# Altium schematic sheet Thermokoppel.SchDoc: Soldeerstation
size A4; Author: Alexander Petry; CompanyName: PXL; SheetNumber: 1; SheetTotal: 5
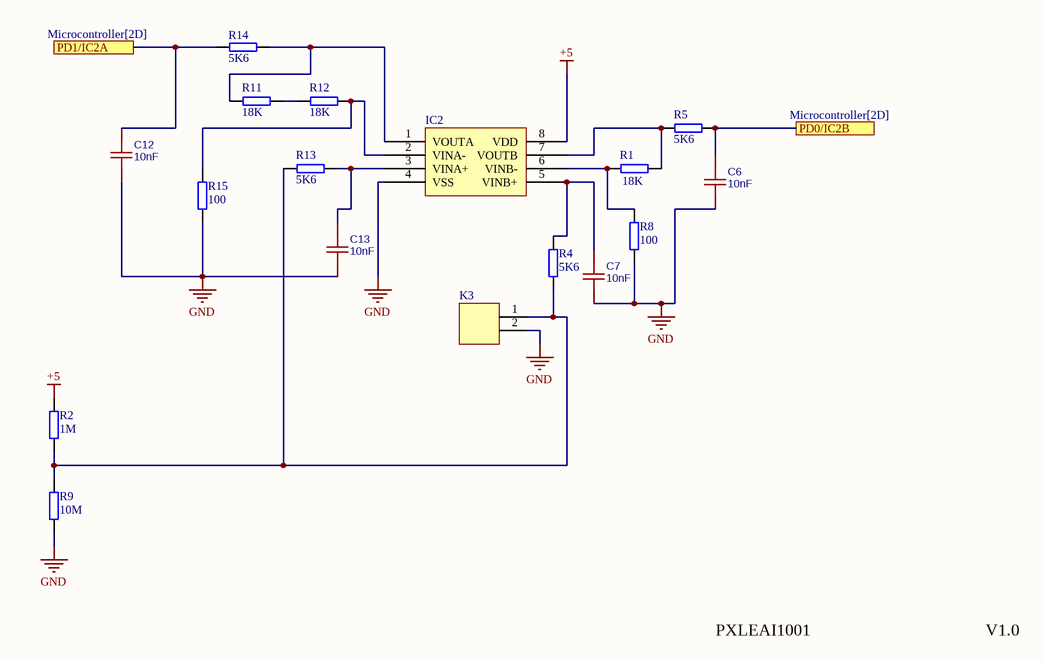
[diagram p0: Thermokoppel.SchDoc]

## Parts
C6  10nF  [C6,7,12,13 10nF]
C7  10nF  [C6,7,12,13 10nF]
C12  10nF  [C6,7,12,13 10nF]
C13  10nF  [C6,7,12,13 10nF]
IC2  (no value)  [IC2 opamps]
K3  (no value)  [Terminal_2]
R1  18K  [RESC2013X50X30ML20T20]
R2  1M  [RESC2013X50X30ML20T20]
R4  5K6  [RESC2013X50X30ML20T20]
R5  5K6  [RESC2013X50X30ML20T20]
R8  100  [RESC2013X50X30ML20T20]
R9  10M  [RESC2013X50X30ML20T20]
R11  18K  [RESC2013X50X30ML20T20]
R12  18K  [RESC2013X50X30ML20T20]
R13  5K6  [RESC2013X50X30ML20T20]
R14  5K6  [RESC2013X50X30ML20T20]
R15  100  [RESC2013X50X30ML20T20]

## Ports
PD0/IC2B (see Microcontroller[2D]), PD1/IC2A (see Microcontroller[2D])

## Nets
+5: IC2.8(VDD) R2.2
GND: C6.1 C7.1 C12.1 C13.1 IC2.4(VSS) K3.2 R8.1 R9.1 R15.1
PD0/IC2B: C6.2 R5.1 ; port PD0/IC2B
PD1/IC2A: C12.2 R14.1 ; port PD1/IC2A
NetC7_2: C7.2 IC2.5(VINB+) R4.1
NetC13_2: C13.2 IC2.3(VINA+) R13.2
NetIC2_1: IC2.1(VOUTA) R11.2 R14.2
NetIC2_2: IC2.2(VINA-) R12.2 R15.2
NetIC2_6: IC2.6(VINB-) R1.1 R8.2
NetIC2_7: IC2.7(VOUTB) R1.2 R5.2
NetK3_1: K3.1 R2.1 R4.2 R9.2 R13.1
NetR11_1: R11.1 R12.1

## Notes on the sheet
- PXLEAI1001
- V1.0

## Library data of the parts
C6 C7 C12 C13 = C6,7,12,13 10nF: BOM_Manufacturer: CCTC(三环); BOM_Manufacturer Part: TCC0805X7R103M500DT; nameAlias: Capacitance; Contributor: LCSC; BOM_Supplier: LCSC; BOM_Supplier Part: C376921; BOM_JLCPCB Part Class: Extended Part; spicePre: C; spiceSymbolName: TCC0805X7R103M500DT
IC2 = IC2 dual opamps
K3 = K Terminal_2
R1 R2 R4 R5 R8 R9 R11-R15 = R Resistor: Manufacturer: Vishay Dale; Part Number: CRCW08050000Z0EA